# EasyEDA Pro project FLightController.epro

# Schematic Schematic1
Board Name: Board1; Create Date: 2025-12-29; Page Name: P1; Project Name: dapcb; Schematic Name: Schematic1; Update Date: 2026-01-04; Company: EasyEDA.com; Page Size: A4; Version: V1.0
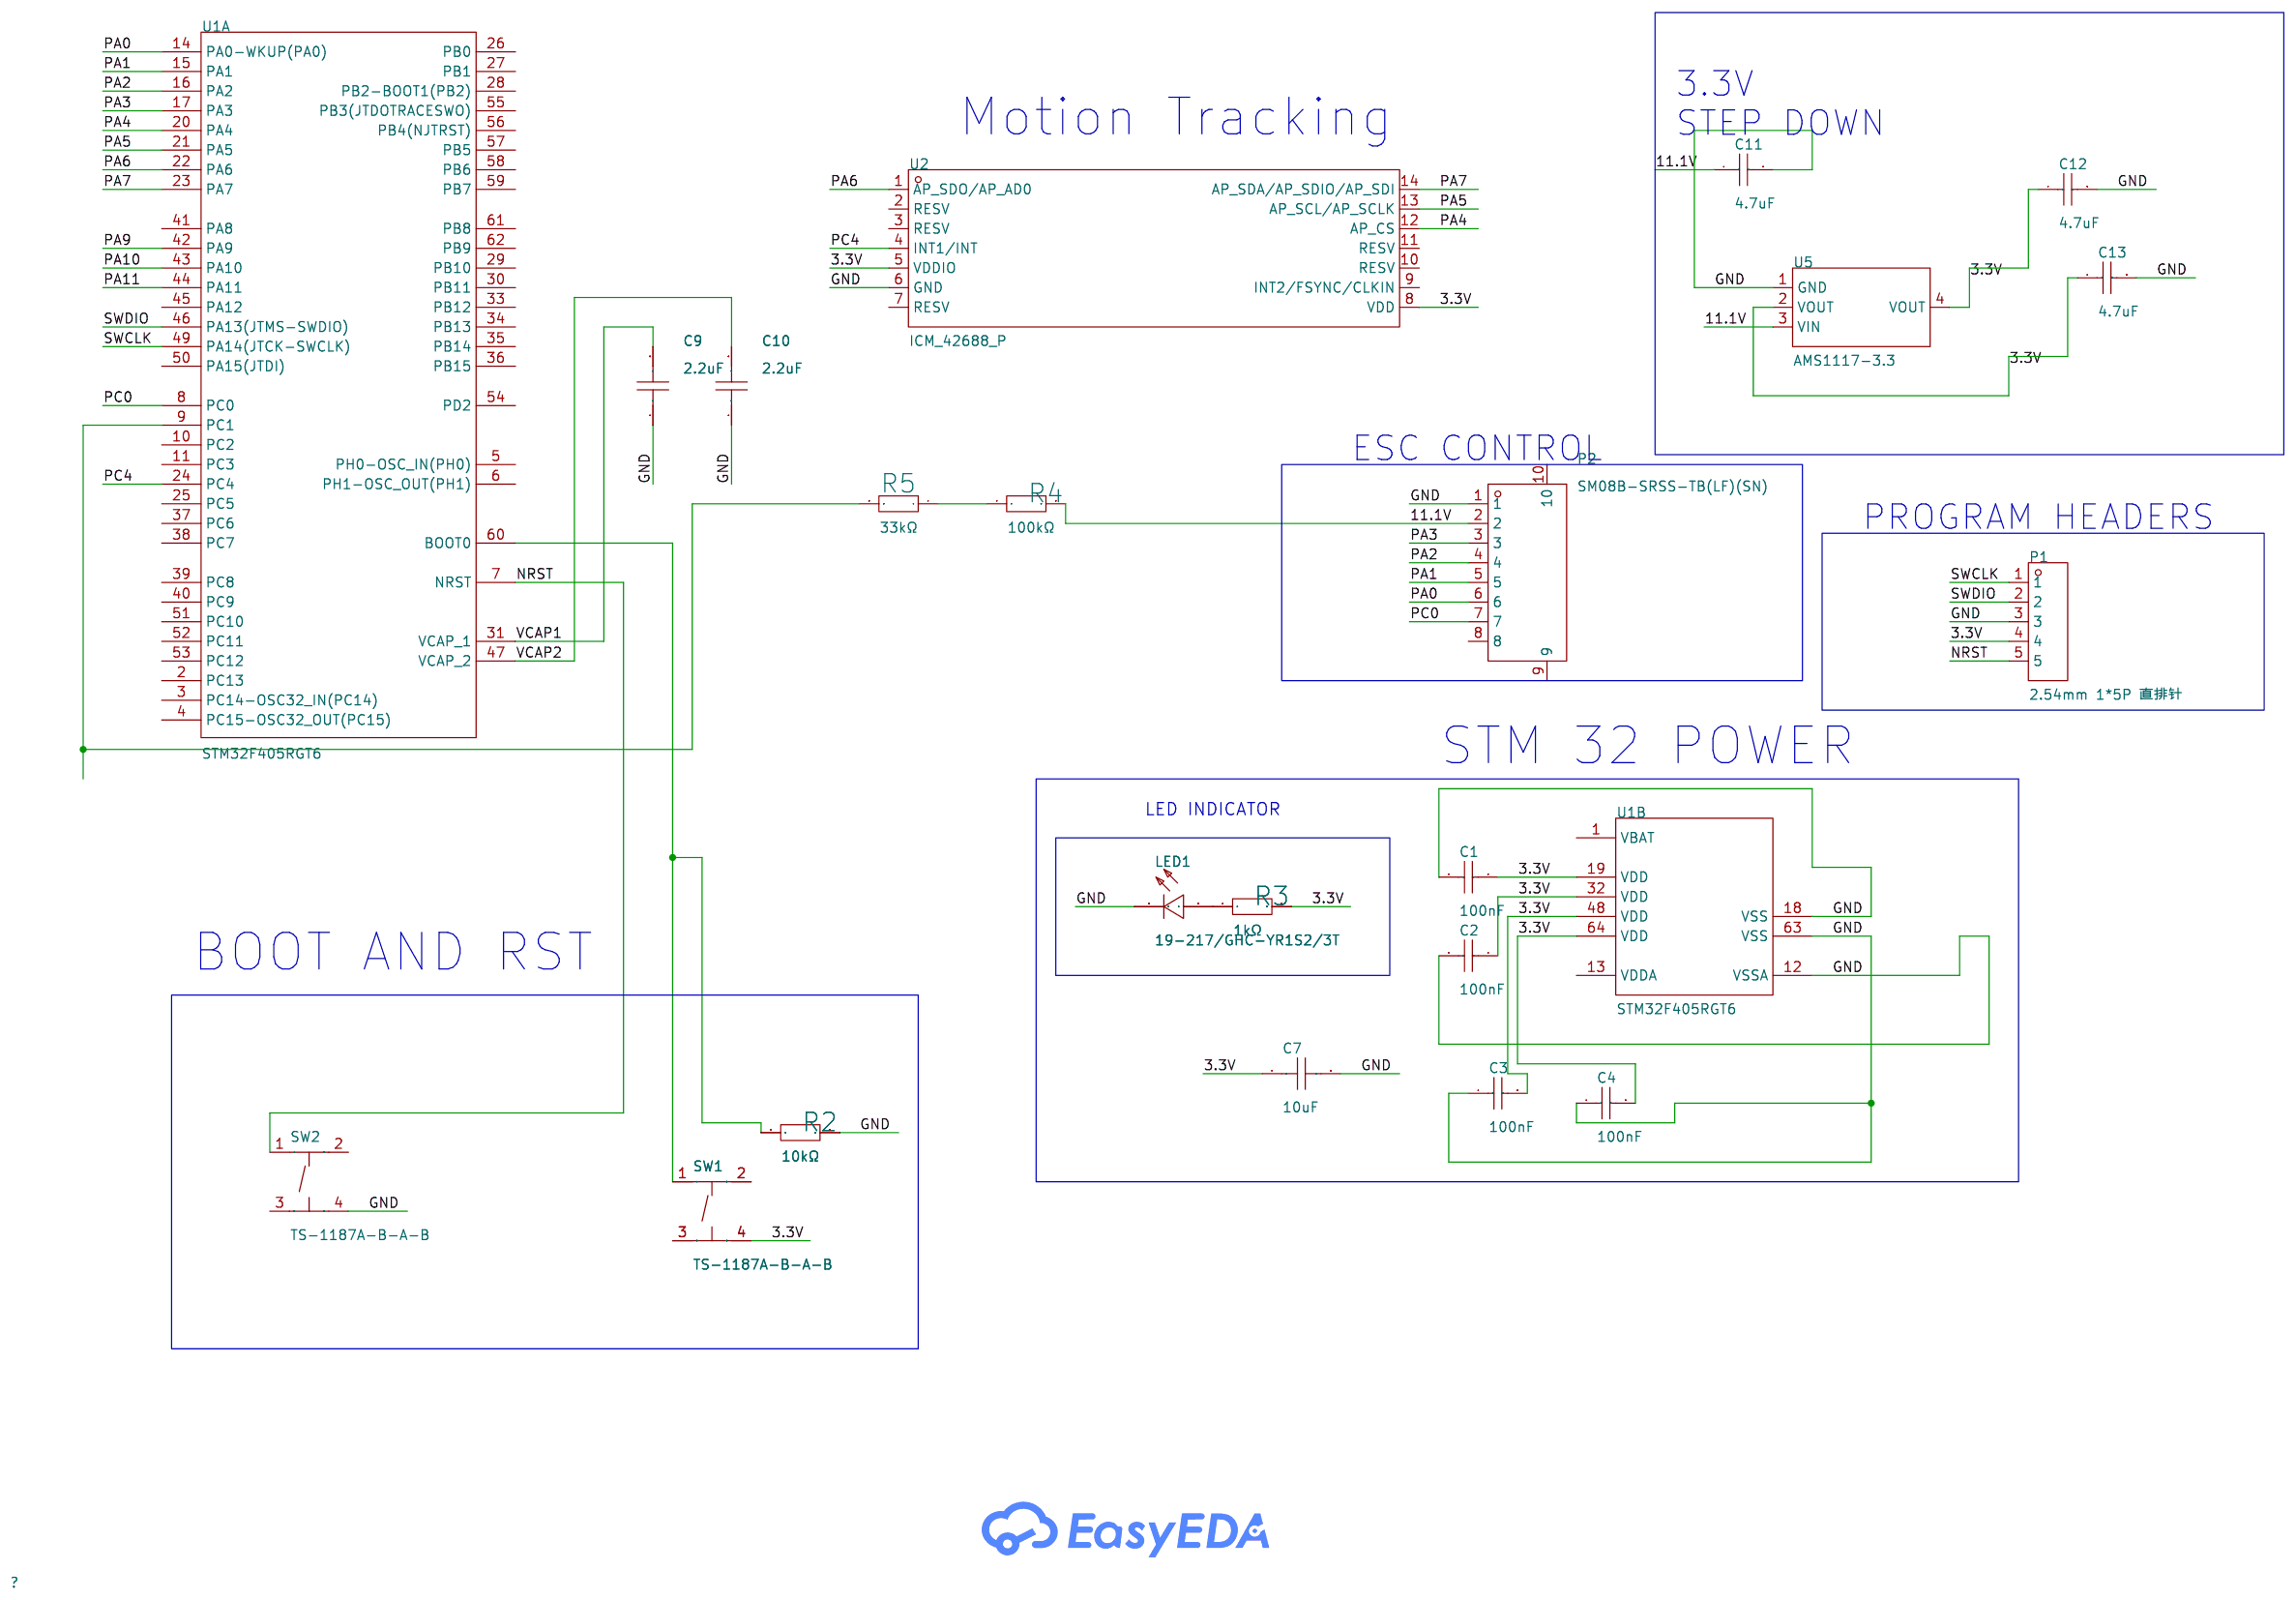
[diagram p0: schematic sheet]

## Parts
C1  100nF  [C0603]
C2  100nF  [C0603]
C3  100nF  [C0603]
C4  100nF  [C0603]
C7  10uF  [C0805]
C9  2.2uF  [C0603]
C10  2.2uF  [C0603]
C11  4.7uF  [C0805]
C12  4.7uF  [C0805]
C13  4.7uF  [C0805]
LED1  19-217/GHC-YR1S2/3T  [LED0603-RD]
P1  2.54mm 1*5P 直排针  [HDR-TH_5P-P2.54-V-M]
P2  SM08B-SRSS-TB(LF)(SN)  [CONN-TH_SM08B-SRSS-TB-LF-SN]
R2  10kΩ  [R0603]
R3  1kΩ  [R0603]
R4  100kΩ  [R0603]
R5  33kΩ  [R0603]
SW1  TS-1187A-B-A-B  [SW-SMD_4P-L5.1-W5.1-P3.70-LS6.5-TL_H1.5]
SW2  TS-1187A-B-A-B  [SW-SMD_4P-L5.1-W5.1-P3.70-LS6.5-TL_H1.5]
U1  STM32F405RGT6  [LQFP-64_L10.0-W10.0-P0.50-LS12.0-BL]  (sections 1,2)
U2  ICM_42688_P  [LGA-14_L3.0-W2.5-P0.50-TL]
U5  AMS1117-3.3  [SOT-223-3_L6.5-W3.4-P2.30-LS7.0-BR]

## Library data of the parts
C1-C4 = GRM188R71C104KA01D: Capacitance: Tolerance:±10% Tolerance:±10% Voltage Rated: Temperature Coefficient:; LCSC Part Name: 100nF ±10% 16V; Supplier Part: C45000; Manufacturer: muRata(村田); Supplier Footprint: 0603; JLCPCB Part Class: Extended Part; Datasheet: https://atta.szlcsc.com/upload/public/pdf/source/20161108/1478586365848.pdf; Supplier: LCSC; Tolerance: ±10%
C7 = TCC0805X5R106K160FTN: Capacitance:10uF Tolerance:±10% Tolerance:±10% Voltage Rating:16V Temperature Coefficient:X5R; LCSC Part Name: 10uF ±10% 16V; Supplier Part: C18185764; Manufacturer: CCTC(三环); Supplier Footprint: 0805; JLCPCB Part Class: Extended Part; Datasheet: https://item.szlcsc.com/datasheet/TCC0805X5R106K160FTN/19332538.html; Supplier: LCSC; Tolerance: ±10%; Voltage Rating: 16V; Temperature Coefficient: X5R
C9 C10 = CC0603KRX5R8BB225: Capacitance:2.2uF Tolerance:±10% Tolerance:±10% Voltage Rating:25V Temperature Coefficient:X5R; LCSC Part Name: 2.2uF ±10% 25V; Supplier Part: C309478; Manufacturer: YAGEO(国巨); Supplier Footprint: 0603; JLCPCB Part Class: Extended Part; Datasheet: https://item.szlcsc.com/datasheet/CC0603KRX5R8BB225/293094.html; Supplier: LCSC; Tolerance: ±10%; Voltage Rating: 25V; Temperature Coefficient: X5R
C11-C13 = CL21A475KAQNNNE: Capacitance:4.7uF Tolerance:±10% Tolerance:±10% Voltage Rating:25V Temperature Coefficient:X5R; LCSC Part Name: 4.7uF ±10% 25V; Supplier Part: C1779; Manufacturer: SAMSUNG(三星); Supplier Footprint: 0805; JLCPCB Part Class: Basic Part; Datasheet: https://item.szlcsc.com/datasheet/CL21A475KAQNNNE/2131.html; Supplier: LCSC; Tolerance: ±10%; Voltage Rating: 25V; Temperature Coefficient: X5R
LED1 = 19-217/GHC-YR1S2/3T: Illumination Color:Emerald Green Voltage - Forward(Vf):3.3V Voltage - Forward(Vf):3.3V Power(Watts):110mW Forward Current:20mA Wavelength - Dominant:520nm~535nm Wavelength - Dominant:520nm~535nm Peak Wavelength:518nm Diode Configuration:- Lens Color:Water; LCSC Part Name: 翠绿 停产; Supplier Part: C72043; Manufacturer: EVERLIGHT(亿光); Supplier Footprint: 0603; JLCPCB Part Class: Extended Part; Supplier: LCSC; Illumination Color: Emerald Green; Voltage - Forward(Vf): 3.3V; Power(Watts): 110mW; Forward Current: 20mA; Wavelength - Dominant: 520nm~535nm; Peak Wavelength: 518nm; Lens Color: Water Clear; Luminous Intensity: 199mcd; Viewing Angle: 120°; Operating Temperature: -40℃~+85℃
P1 = 2.54mm 1*5P 直排针: Circluar Pins/Square Pins:- Current Rating (Max):- Voltage Rating (Max):- Length of Mating Pin:- Insulation Height:- Contact Material:; Supplier Part: C50951; JLCPCB Part Class: Extended Part; Supplier: LCSC
P2 = SM08B-SRSS-TB(LF)(SN): Pins Structure:1x8P Pitch:1mm Mounting Type:Surface Mount, Right Angle Reference Series:SH Number of Pins:8P Number of Rows:1 Number of PINs Per Row:8 Row Spacing:- Current Rating:1A Contact Material:Copper Alloy Contact Plating:Tin Operating Temperature:; LCSC Part Name: 1x8P 间距:1mm 卧贴 系列:SH; Supplier Part: C160407; Manufacturer: JST; Supplier Footprint: SMD,P=1mm,卧贴; JLCPCB Part Class: Extended Part; Datasheet: https://item.szlcsc.com/datasheet/SM08B-SRSS-TB(LF)(SN)/171787.html; Supplier: LCSC; Pins Structure: 1x8P; Pitch: 1mm; Mounting Type: Surface Mount, Right Angle; Reference Series: SH; Number of Pins: 8P; Number of Rows: 1; Number of PINs Per Row: 8; Current Rating: 1A; Contact Material: Copper Alloy; Contact Plating: Tin; Operating Temperature: -25℃~+85℃; Voltage Rating: 50V; Plastic Material: PA; Flame Retardant Rating: UL94V-0; Supplementary Features: Auxiliary Solder Pin; Color: White; Z-Height of the Board: 2.9mm; X-Length of Bottom Edge on Board (Spacing Line): 10mm; Y-Width of Bottom Edge on Board: 4.32mm
R2-R5 = 0603WAF1002T5E: Type:Thick Film Resistor Resistance:10kΩ Tolerance:±1% Tolerance:±1% Power(Watts):100mW Voltage-Supply(Max):75V Temperature Coefficient:±100ppm/℃ Temperature Coefficient:±100ppm/℃ Operating Temperature:-55℃~+155℃ Operating Temperature:-55℃~+155℃; LCSC Part Name: 厚膜电阻 10kΩ ±1% 100mW; Supplier Part: C25804; Manufacturer: UNI-ROYAL(厚声); Supplier Footprint: 0603; JLCPCB Part Class: Basic Part; Datasheet: https://item.szlcsc.com/datasheet/0603WAF1002T5E/26547.html; Supplier: LCSC; Type: Thick Film Resistor; Tolerance: ±1%; Power(Watts): 100mW; Voltage-Supply(Max): 75V; Temperature Coefficient: ±100ppm/℃; Operating Temperature: -55℃~+155℃
SW1 SW2 = TS-1187A-B-A-B: Circuit:SPST Actuator Style:Round Button Operating Force:1.6N Mounting Type:Surface Mount,Vertical Length:5.1mm Width:5.1mm Switch Height:1.5mm with Bracket:Without Bracket Contact Current:50mA Voltage Rating:12V Actuator/Cap Color:Gold With Lamp:No Life:; LCSC Part Name: 5.1*5.1*1.5mm 立贴 轻触开关; Supplier Part: C318884; Manufacturer: XKB Connection(中国星坤); Supplier Footprint: SMD; JLCPCB Part Class: Basic Part; Datasheet: https://item.szlcsc.com/datasheet/TS-1187A-B-A-B/299976.html; Supplier: LCSC; Circuit: SPST; Actuator Style: Round Button; Operating Force: 1.6N; Mounting Type: Surface Mount,Vertical; Length: 5.1mm; Width: 5.1mm; Switch Height: 1.5mm; with Bracket: Without Bracket; Contact Current: 50mA; Voltage Rating: 12V; Actuator/Cap Color: Gold; With Lamp: No; Life: 100,000 Cycles; Operating Temperature: -30℃~+85℃
U1 = STM32F405RGT6: CPU Core:ARM-M4 CPU Maximum Speed:168MHz Program Storage Size:1MB Program Memory Type:FLASH Number of I/O:51 ADC (Bit):12bit DAC (Bit):12bit Voltage - Supply:1.8V~3.6V Voltage - Supply:1.8V~3.6V Applications:-; LCSC Part Name: 带DSP和FPU的高性能基础系列ARM Cortex-M4 MCU，具有1 MB Flash、168 MHz CPU和ART加速器; Supplier Part: C15742; Manufacturer: ST(意法半导体); Supplier Footprint: LQFP-64(10x10); JLCPCB Part Class: Extended Part; Datasheet: https://item.szlcsc.com/datasheet/STM32F405RGT6/16424.html; Supplier: LCSC; CPU Core: ARM-M4; CPU Maximum Speed: 168MHz; Program Storage Size: 1MB; Program Memory Type: FLASH; Number of I/O: 51; ADC (Bit): 12bit; DAC (Bit): 12bit; Voltage - Supply: 1.8V~3.6V
U2 = ICM_42688_P: Supplier Part: C9900096044; JLCPCB Part Class: Extended Part; Supplier: LCSC
U5 = AMS1117-3.3_C6186: Output Type:Fixed Voltage - Supply:16V Output Voltage:3.3V Output Voltage:3.3V Output Current:1A Power Supply Rejection Ratio (PSRR):72dB@(120Hz) Voltage Dropout:1.1V@(800mA) standby current:5mA Noise:0.003%Vout Features:Over Current Protection；Over Tempe; LCSC Part Name: 输出3.3V 1A; Supplier Part: C6186; Manufacturer: AMS; Supplier Footprint: SOT-223; Datasheet: https://item.szlcsc.com/datasheet/AMS1117-3.3/6652.html; Supplier: LCSC; Output Type: Fixed; Voltage - Supply: 16V; Output Voltage: 3.3V; Output Current: 1A; Power Supply Rejection Ratio (PSRR): 72dB@(120Hz); Voltage Dropout: 1.1V@(800mA); standby current: 5mA; Noise: 0.003%Vout; Features: Over Current Protection；Over Temperature Protection; Operating Temperature: -40℃~+125℃; Output Configuration: Positive; Number of Outputs: 1

## Nets
3.3V: C1.2 C2.2 C3.2 C4.2 C7.1 C12.1 C13.1 P1.4 R3.2 SW1.4(D) U1.19(VDD) U1.32(VDD) U1.48(VDD) U1.64(VDD) U2.5(VDDIO) U2.8(VDD) U5.2(VOUT) U5.4(VOUT)
11.1V: C11.1 P2.2 R4.2 U5.3(VIN)
GND: C1.1 C2.1 C3.1 C4.1 C7.2 C9.1 C10.1 C11.2 C12.2 C13.2 LED1.1(C) P1.3 P2.1 R2.2 SW2.4(D) U1.12(VSSA) U1.18(VSS) U1.63(VSS) U2.6(GND) U5.1(GND)
NRST: P1.5 SW2.1(A) U1.7(NRST)
PA0: P2.6 U1.14(PA0-WKUP(PA0))
PA1: P2.5 U1.15(PA1)
PA2: P2.4 U1.16(PA2)
PA3: P2.3 U1.17(PA3)
PA4: U1.20(PA4) U2.12(AP_CS)
PA5: U1.21(PA5) U2.13(AP_SCL/AP_SCLK)
PA6: U1.22(PA6) U2.1(AP_SDO/AP_AD0)
PA7: U1.23(PA7) U2.14(AP_SDA/AP_SDIO/AP_SDI)
PA9: U1.42(PA9)
PA10: U1.43(PA10)
PA11: U1.44(PA11)
PC0: P2.7 U1.8(PC0)
PC4: U1.24(PC4) U2.4(INT1/INT)
SWCLK: P1.1 U1.49(PA14(JTCK-SWCLK))
SWDIO: P1.2 U1.46(PA13(JTMS-SWDIO))
VCAP1: C9.2 U1.31(VCAP_1)
VCAP2: C10.2 U1.47(VCAP_2)
$1N5243: R2.1 SW1.1(A) U1.60(BOOT0)
$1N6162: LED1.2(A) R3.1
$1N11616: R4.1 R5.1
$1N11620: R5.2 U1.9(PC1)

Not connected (* = marked no-connect by the designer): P2 8 9 10; SW1 2(B) 3(C); SW2 2(B) 3(C); U1 1(VBAT) 2(PC13) 3(PC14-OSC32_IN(PC14)) 4(PC15-OSC32_OUT(PC15)) 5(PH0-OSC_IN(PH0)) 6(PH1-OSC_OUT(PH1)) 10(PC2) 11(PC3) 13(VDDA) 25(PC5) 26(PB0) 27(PB1) 28(PB2-BOOT1(PB2)) 29(PB10) 30(PB11) 33(PB12) 34(PB13) 35(PB14) 36(PB15) 37(PC6) 38(PC7) 39(PC8) 40(PC9) 41(PA8) 45(PA12) 50(PA15(JTDI)) 51(PC10) 52(PC11) 53(PC12) 54(PD2) 55(PB3(JTDOTRACESWO)) 56(PB4(NJTRST)) 57(PB5) 58(PB6) 59(PB7) 61(PB8) 62(PB9); U2 2(RESV) 3(RESV) 7(RESV) 9(INT2/FSYNC/CLKIN) 10(RESV) 11(RESV)

## Notes on the sheet
- 3.3V
  STEP DOWN
- Motion Tracking
- ESC CONTROL
- PROGRAM HEADERS
- STM 32 POWER
- LED INDICATOR
- BOOT AND RST

# Board PCB1
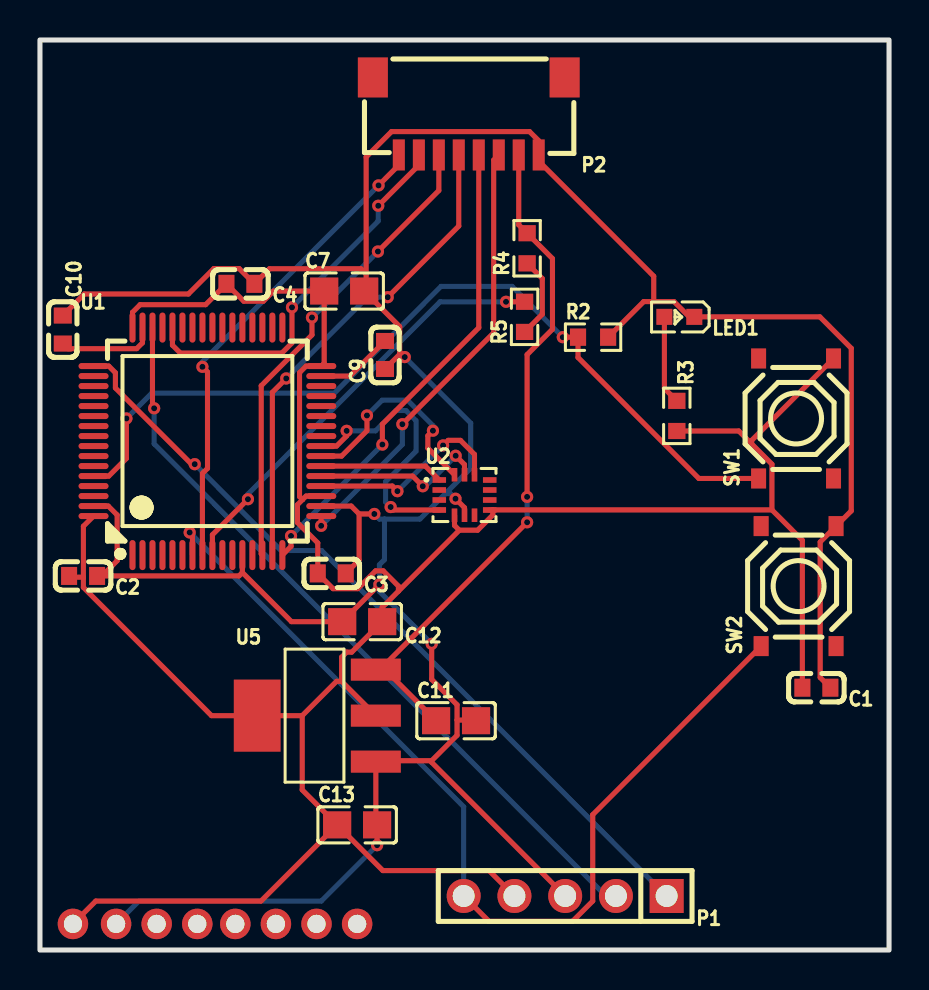
[diagram p1: board, top side]
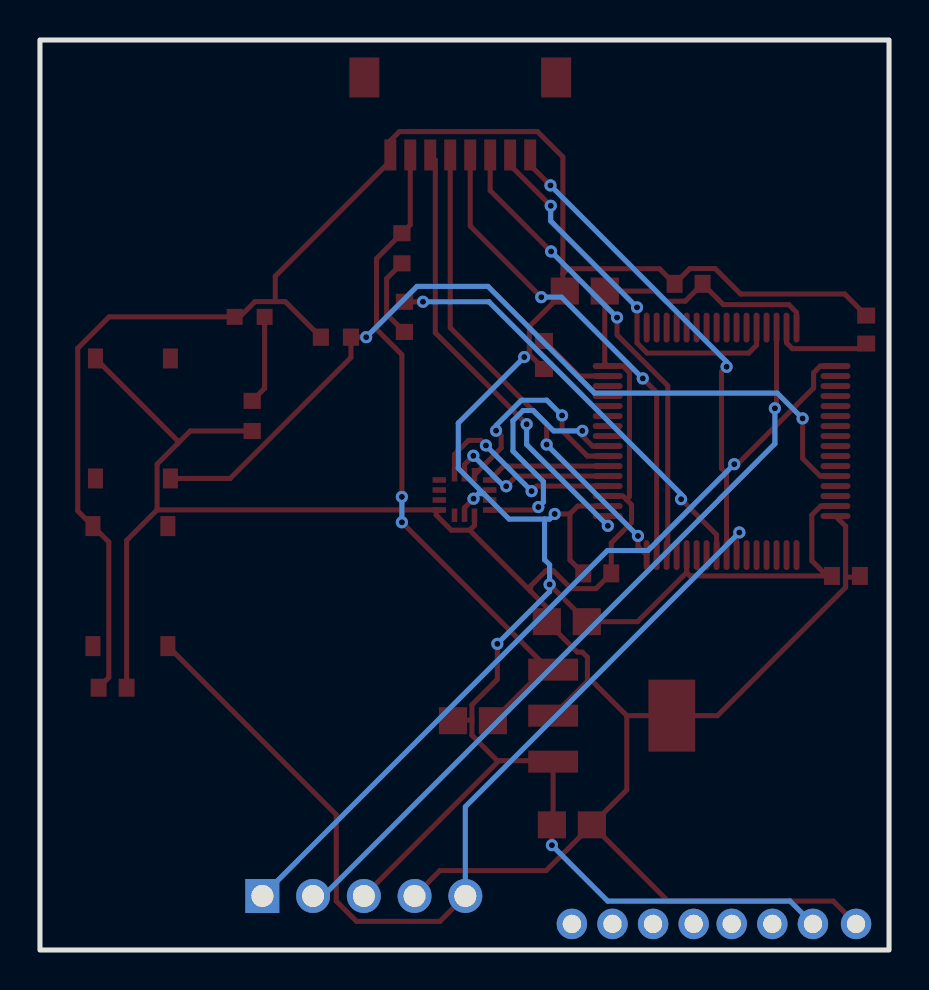
[diagram p2: board, bottom side, seen from below]

Outline 42.5 x 45.5 mm; copper layers: Top Layer, Bottom Layer. Coordinates in mm from the lower left corner of the outline.
Outline path: rectangle 0,45.5 42.5,0
Stack: Top Layer 0.035mm / Dielectric1 1.51mm FR4 er 4.5 / Bottom Layer 0.035mm

## Design rules (mm)
template: JLCPCB Capability(Two Layers Board)
spacing copperThickness1oz (default): track to track 0.102, other pairs 0.152 to 0.3
spacing copperThickness2oz: track to track 0.203, other pairs 0.152 to 0.3
track width copperThickness1oz (default): min 0.127, default 0.254, max 2.54
track width copperThickness2oz: min 0.203, default 0.254, max 2.54
differential pair differentialPair (default): width min 0.127, default 0.254, max 2.54; gap min 0.152, default 0.152
via viaSize (default): diameter min 0.5, default 0.61, max 10; hole min 0.3, default 0.305, max 6.3

## Placement (name value [footprint] x y rotation side)
C1  100nF  [C0603]  38.86 13.12 180 top
C2  100nF  [C0603]  2.16 18.7 180 top
C3  100nF  [C0603]  14.61 18.83 180 top
C4  100nF  [C0603]  10.03 33.31 180 top
C7  10uF  [C0805]  15.23 32.95 0 top
C9  2.2uF  [C0603]  17.27 29.75 90 top
C10  2.2uF  [C0603]  1.14 31.02 270 top
C11  4.7uF  [C0805]  20.83 11.46 0 top
C12  4.7uF  [C0805]  16.13 16.42 180 top
C13  4.7uF  [C0805]  15.87 6.26 0 top
LED1  19-217/GHC-YR1S2/3T  [LED0603-RD]  32 31.66 180 top
NOREF  -  [Pad_e6]  11.81 1.3 0 top
NOREF#2  -  [Pad_e0]  1.65 1.3 0 top
NOREF#3  -  [Pad_e1]  3.81 1.3 0 top
NOREF#4  -  [Pad_e5]  9.78 1.3 0 top
NOREF#5  -  [Pad_e7]  13.84 1.3 0 top
NOREF#6  -  [Pad_e3]  5.84 1.3 0 top
NOREF#7  -  [Pad_e8]  15.87 1.3 0 top
NOREF#8  -  [Pad_e4]  7.87 1.3 0 top
P1  2.54mm 1*5P 直排针  [HDR-TH_5P-P2.54-V-M]  26.29 2.7 180 top
P2  SM08B-SRSS-TB(LF)(SN)  [CONN-TH_SM08B-SRSS-TB-LF-SN]  21.46 41.69 180 top
R2  10kΩ  [R0603]  27.69 30.64 0 top
R3  1kΩ  [R0603]  31.88 26.7 270 top
R4  100kΩ  [R0603]  24.38 35.09 90 top
R5  33kΩ  [R0603]  24.26 31.66 90 top
SW1  TS-1187A-B-A-B  [SW-SMD_4P-L5.1-W5.1-P3.70-LS6.5-TL_H1.5]  37.85 26.58 90 top
SW2  TS-1187A-B-A-B  [SW-SMD_4P-L5.1-W5.1-P3.70-LS6.5-TL_H1.5]  37.97 18.2 90 top
U1  STM32F405RGT6  [LQFP-64_L10.0-W10.0-P0.50-LS12.0-BL]  8.38 25.43 0 top
U2  ICM_42688_P  [LGA-14_L3.0-W2.5-P0.50-TL]  21.25 22.75 0 top
U5  AMS1117-3.3  [SOT-223-3_L6.5-W3.4-P2.30-LS7.0-BR]  13.84 11.72 0 top

## Footprints (pads in the part's own frame, mm; a bottom-side part is the same pattern mirrored in y, then rotated)
C0603
  rect 0.8x0.9 smd: 1(-0.7,0) 2(0.7,0)
C0805
  rect 1.41x1.35 smd: 1(-1,0) 2(1,0)
CONN-TH_SM08B-SRSS-TB-LF-SN
  rect 0.6x1.55 smd: 1(-3.5,1.937) 2(-2.502,1.938) 3(-1.502,1.938) 4(-0.502,1.938) 5(0.5,1.937) 6(1.498,1.938) 7(2.498,1.938) 8(3.5,1.937)
  rect 1.5x2 smd: 9(4.8,-1.938) 10(-4.8,-1.938)
HDR-TH_5P-P2.54-V-M
  rect 1.7x1.7 hole 1.1: 1(-5.08,0)
  round 1.7 hole 1.1: 2(-2.54,0) 3(0,0) 4(2.54,0) 5(5.08,0)
LED0603-RD
  rect 0.8x0.8 smd: 1(-0.749,0) 2(0.749,0)
LGA-14_L3.0-W2.5-P0.50-TL
  rect 0.675x0.28 smd: 1(-1.262,0.75) 2(-1.262,0.25) 3(-1.262,-0.25) 4(-1.262,-0.75) 8(1.262,-0.75) 9(1.262,-0.25) 10(1.262,0.25) 11(1.262,0.75)
  rect 0.28x0.675 smd: 5(-0.5,-1.012) 6(0,-1.012) 7(0.5,-1.012) 12(0.5,1.012) 13(0,1.012) 14(-0.5,1.012)
LQFP-64_L10.0-W10.0-P0.50-LS12.0-BL
  oval 0.3x1.5 smd: 1(-3.75,-5.688) 2(-3.25,-5.688) 3(-2.75,-5.688) 4(-2.25,-5.688) 5(-1.75,-5.688) 6(-1.25,-5.688) 7(-0.75,-5.688) 8(-0.25,-5.688) 9(0.25,-5.688) 10(0.75,-5.688) 11(1.25,-5.688) 12(1.75,-5.688) 13(2.25,-5.688) 14(2.75,-5.688) 15(3.25,-5.688) 16(3.75,-5.688) 33(3.75,5.688) 34(3.25,5.688) 35(2.75,5.688) 36(2.25,5.688) 37(1.75,5.688) 38(1.25,5.688) 39(0.75,5.688) 40(0.25,5.688) 41(-0.25,5.688) 42(-0.75,5.688) 43(-1.25,5.688) 44(-1.75,5.688) 45(-2.25,5.688) 46(-2.75,5.688) 47(-3.25,5.688) 48(-3.75,5.688)
  oval 1.5x0.3 smd: 17(5.7,-3.738) 18(5.7,-3.238) 19(5.7,-2.738) 20(5.7,-2.238) 21(5.7,-1.738) 22(5.7,-1.238) 23(5.7,-0.739) 24(5.7,-0.238) 25(5.7,0.262) 26(5.7,0.762) 27(5.7,1.262) 28(5.7,1.762) 29(5.7,2.261) 30(5.7,2.762) 31(5.7,3.261) 32(5.7,3.762) 49(-5.7,3.762) 50(-5.7,3.261) 51(-5.7,2.762) 52(-5.7,2.261) 53(-5.7,1.762) 54(-5.7,1.262) 55(-5.7,0.762) 56(-5.7,0.262) 57(-5.7,-0.238) 58(-5.7,-0.739) 59(-5.7,-1.238) 60(-5.7,-1.738) 61(-5.7,-2.238) 62(-5.7,-2.738) 63(-5.7,-3.238) 64(-5.7,-3.738)
Pad_e0
  round 1.524 hole 0.914: 1(0,0)
Pad_e1
  round 1.524 hole 0.914: 2(0,0)
Pad_e3
  round 1.524 hole 0.914: 3(0,0)
Pad_e4
  round 1.524 hole 0.914: 4(0,0)
Pad_e5
  round 1.524 hole 0.914: 5(0,0)
Pad_e6
  round 1.524 hole 0.914: 6(0,0)
Pad_e7
  round 1.524 hole 0.914: 7(0,0)
Pad_e8
  round 1.524 hole 0.914: 8(0,0)
R0603
  rect 0.806x0.864 smd: 1(-0.753,0) 2(0.753,0)
SOT-223-3_L6.5-W3.4-P2.30-LS7.0-BR
  rect 2.5x1.1 smd: 1(2.97,-2.3) 2(2.97,0) 3(2.97,2.3)
  rect 2.34x3.6 smd: 4(-2.97,0)
SW-SMD_4P-L5.1-W5.1-P3.70-LS6.5-TL_H1.5
  rect 1x0.75 smd: 1(-3,1.875) 2(3,1.875) 3(-3,-1.875) 4(3,-1.875)

## Nets
As in the schematic, except:
3.3V: C1.2 C2.2 C3.2 C4.2 C7.1 C12.1 C13.1 NOREF#2.1 P1.4 R3.2 SW1.4 U1.19 U1.32 U1.48 U1.64 U2.5 U2.8 U5.2 U5.4
GND: C1.1 C2.1 C3.1 C4.1 C7.2 C9.1 C10.1 C11.2 C12.2 C13.2 LED1.1 NOREF#3.2 P1.3 P2.1 R2.2 SW2.4 U1.12 U1.18 U1.63 U2.6 U5.1
PA11: P2.7 U1.44
PC0: P2.8 U1.8

Pads without a net: P2 9 10; SW1 2 3; SW2 2 3; U1 1 2 3 4 5 6 10 11 13 25 26 27 28 29 30 33 34 35 36 37 38 39 40 41 45 50 51 52 53 54 55 56 57 58 59 61 62; U2 2 3 7 9 10 11

## Via types
v1: diameter 0.61, hole 0.305, Top Layer to Bottom Layer, 35 vias

## Routing (per net, layer and track width the routed paths; a pad name or vN(x,y) marks a point on that pad's centre or on a via; arc(x,y) is an arc through that point)
3.3V: length 139.1
  Top Layer w0.254: 22.67,22.01 U2.8 ; 22.67,22.01 22.67,21.75 21.91,20.99 20.99,20.99 ; 22.67,22.01 36.64,22.01 ; C1.2 38.16,20.48 36.64,22.01 ; 20.99,20.99 17.94,17.94 ; 20.99,20.99 20.75,21.23 U2.5 ; 17.94,17.94 17.94,18.2 17.18,18.96 16.8,18.96 15.91,18.07 14.67,18.07 C3.2 13.9,20.35 12.89,21.37 12.89,22.26 13.14,22.52 ; 17.94,17.94 17.13,17.13 C12.1 15.61,14.89 15.35,14.89 15.1,14.64 15.1,13.43 ; 13.13,11.72 14.84,13.43 15.1,13.43 ; 13.13,11.72 U5.4 8.59,11.72 2.17,18.13 2.17,18.64 ; 13.13,11.72 13.13,8.01 C13.1 ; 2.17,18.64 1.52,18.64 C2.2 ; 2.17,18.64 2.17,21.19 U1.64 ; 13.14,22.52 13.32,22.7 U1.19 ; 13.14,22.52 12.99,22.67 12.99,28.87 13.32,29.2 U1.32 14.23,29.34 C7.1 11.69,32.95 11.18,32.44 10.2,32.44 C4.2 8.29,32.27 5.02,32.27 4.63,31.88 U1.48 ; 15.1,13.43 U5.2 ; 35.62,25.31 34.98,25.95 R3.2 ; 35.62,25.31 36.64,24.29 36.64,22.01 ; 35.62,25.31 35.62,25.48 SW1.4 ; C13.1 11.06,2.45 2.79,2.45 NOREF#2.1 ; C13.1 17.16,3.97 22.48,3.97 P1.4
11.1V: length 34
  Top Layer w0.254: C11.1 17.29,14 ; 17.29,14 16.83,14 U5.3 ; 17.29,14 17.29,14.29 v1(24.38,21.39) ; v1(24.38,22.66) 24.38,29.77 25.65,31.04 25.65,34.57 R4.2 23.96,36.26 P2.2
  Bottom Layer w0.254: v1(24.38,21.39) v1(24.38,22.66)
GND: length 169.1
  Top Layer w0.254: 19.61,9.47 16.86,9.47 U5.1 16.81,6.32 C13.2 v1(16.87,5.24) ; 19.61,9.47 20.88,10.74 20.88,11.5 ; 19.61,9.47 19.61,9.38 P1.3 ; 15.97,21.8 15.58,22.2 U1.18 ; 15.97,21.8 v1(16.74,21.8) ; 15.97,21.8 15.97,19.5 C3.1 ; C9.1 18.01,29.79 18.01,29.9 ; C11.2 21.8,11.5 20.88,11.5 ; U1.63 3.42,22.2 3.86,21.75 3.86,19.47 3.1,18.7 ; 10.13,18.87 12.59,16.42 C12.2 v1(16.99,18.28) ; 10.13,18.87 9.96,18.7 3.1,18.7 ; 10.13,18.87 U1.12 ; 20.88,11.5 20.88,12.26 19.61,13.53 v1(19.61,15.31) ; R2.2 30.22,32.42 30.72,32.42 ; 3.1,18.7 C2.1 ; U2.6 21.25,22.11 v1(20.8,22.56) ; 18.01,29.9 18.01,31.17 C7.2 16.33,33.05 16.33,33.81 ; 18.01,29.9 v1(18.26,29.65) ; 30.72,32.42 31.74,32.42 32.5,31.66 LED1.1 39.04,31.66 40.61,30.09 40.61,21.96 SW2.4 39.05,20.4 39.05,13.62 39.56,13.12 ; 30.72,32.42 30.72,33.69 24.96,39.45 24.96,40.46 24.51,40.92 17.6,40.92 16.33,39.65 16.33,33.81 ; 16.33,33.81 16.07,34.06 11.49,34.06 C4.1 9.97,34.07 8.7,34.07 7.43,32.8 2.22,32.8 C10.1
  Bottom Layer w0.254: NOREF#3.2 4.95,2.45 14.08,2.45 v1(16.87,5.24) ; 20.29,22.82 19.02,21.55 17.24,21.55 ; 20.29,22.82 21.56,24.09 21.56,26.34 v1(18.26,29.65) ; 20.29,22.82 20.55,22.82 v1(20.8,22.56) ; 17.24,21.55 16.99,21.55 v1(16.74,21.8) ; 17.24,21.55 17.24,19.52 16.99,19.26 v1(16.99,18.28) 16.99,17.92 v1(19.61,15.31)
NRST: length 48.7
  Top Layer w0.254: P1.5 22.48,1.43 26.65,1.43 27.67,2.45 27.67,6.77 SW2.1 ; v1(7.49,20.88) 7.63,20.74 U1.7
  Bottom Layer w0.254: v1(7.49,20.88) 21.21,7.16 P1.5
PA0: length 23.7
  Top Layer w0.254: U1.14 11.08,19.8 11.08,28.21 13.61,30.75 v1(13.61,31.62) ; P2.6 19.96,37.97 v1(16.92,34.93)
  Bottom Layer w0.254: v1(16.92,34.93) v1(13.61,31.62)
PA1: length 24.5
  Top Layer w0.254: v1(17.41,32.64) 20.96,36.2 20.96,39.75 ; U1.15 11.63,27.88 v1(12.33,28.58)
  Bottom Layer w0.254: v1(12.33,28.58) 16.39,32.64 v1(17.41,32.64)
PA2: length 24.1
  Top Layer w0.254: v1(12.57,20.7) 12.57,20.18 U1.16 ; P2.4 21.96,31.12 17.14,26.29 v1(17.14,25.27)
  Bottom Layer w0.254: v1(17.14,25.27) v1(12.57,20.7)
PA3: length 22.7
  Top Layer w0.254: U1.17 14.08,21.69 v1(14.08,21.21) ; v1(18.14,26.29) 22.71,30.86 22.71,39.5 P2.3
  Bottom Layer w0.254: v1(14.08,21.21) 18.14,25.27 v1(18.14,26.29)
PA4: length 10.1
  Top Layer w0.254: v1(17.89,22.94) 17.64,23.2 U1.20 ; U2.12 21.75,24.78 21.05,25.48 20.43,25.48 v1(20.18,25.23)
  Bottom Layer w0.254: v1(17.89,22.94) v1(20.18,25.23)
PA5: length 8.7
  Top Layer w0.254: U1.21 18.65,23.7 v1(19.16,23.19) ; v1(20.81,24.71) 21.25,24.27 U2.13
  Bottom Layer w0.254: v1(20.81,24.71) 19.28,23.19 v1(19.16,23.19)
PA6: length 6.2
  Top Layer w0.254: U1.22 19.29,24.2 U2.1
PA7: length 10.8
  Top Layer w0.254: U1.23 15.1,24.7 16.37,25.97 v1(16.37,26.73) ; v1(19.67,25.97) 19.42,25.71 19.42,25.1 U2.14
  Bottom Layer w0.254: v1(19.67,25.97) 19.67,26.22 18.4,27.49 17.13,27.49 v1(16.37,26.73)
PA11: length 19.3
  Top Layer w0.254: v1(16.93,37.21) 18.96,39.24 P2.7 ; v1(12.61,32.13) 12.61,30.35 12.11,29.85 7.03,29.85 6.63,30.24 U1.44
  Bottom Layer w0.254: v1(16.93,37.21) 16.93,36.45 v1(12.61,32.13)
PC0: length 24.3
  Top Layer w0.254: v1(8.13,29.16) 8.39,28.91 8.39,24.08 8.13,23.83 U1.8 ; 17.96,39.75 17.96,39.25 v1(16.95,38.23)
  Bottom Layer w0.254: v1(8.13,29.16) 8.13,29.41 v1(16.95,38.23)
PC4: length 13.4
  Top Layer w0.254: v1(15.35,25.96) 15.35,25.7 14.84,25.2 U1.24 ; v1(17.55,22.15) 17.7,22 U2.4
  Bottom Layer w0.254: v1(17.55,22.15) 17.3,22.4 17.3,23.42 18.82,24.94 18.82,26.47 18.32,26.97 17.81,26.97 16.79,25.96 v1(15.35,25.96)
SWCLK: length 40.1
  Top Layer w0.254: U1.49 3.44,29.2 3.78,28.86 3.78,28.1 7.59,24.29 v1(7.75,24.29)
  Bottom Layer w0.254: P1.1 14.1,19.97 12.06,19.97 v1(7.75,24.29)
SWDIO: length 38.3
  Top Layer w0.254: U1.46 5.63,27.17 v1(5.71,27.09)
  Bottom Layer w0.254: v1(5.71,27.09) 5.71,25.31 28.32,2.7 P1.2
VCAP1: length 3.9
  Top Layer w0.254: C9.2 15.52,28.7 U1.31
VCAP2: length 5
  Top Layer w0.254: C10.2 1.4,30.07 4.84,30.07 5.13,30.36 U1.47
$1N5243: length 43
  Top Layer w0.254: v1(4.33,26.58) 4.33,24.58 3.44,23.7 U1.60 ; v1(26.17,30.64) R2.1 26.93,29.63 32.98,23.58 SW1.1
  Bottom Layer w0.254: v1(4.33,26.58) 5.6,27.85 14.74,27.85 20.07,33.18 23.63,33.18 v1(26.17,30.64)
$1N6162: length 4.5
  Top Layer w0.254: R3.1 31.25,28.08 LED1.2
$1N11616: length 4.1
  Top Layer w0.254: R4.1 25.15,33.57 25.15,31.79 R5.1
$1N11620: length 21.6
  Top Layer w0.254: U1.9 8.63,20.76 v1(10.41,22.54) ; v1(23.33,32.41) R5.2
  Bottom Layer w0.254: v1(23.33,32.41) 20.03,32.41 10.41,22.79 v1(10.41,22.54)
